# Altium schematic sheet EPS_Local-Supply_Channel.SchDoc: Local Supply / Channel
size A3; SheetNumber: 34; SheetTotal: 51
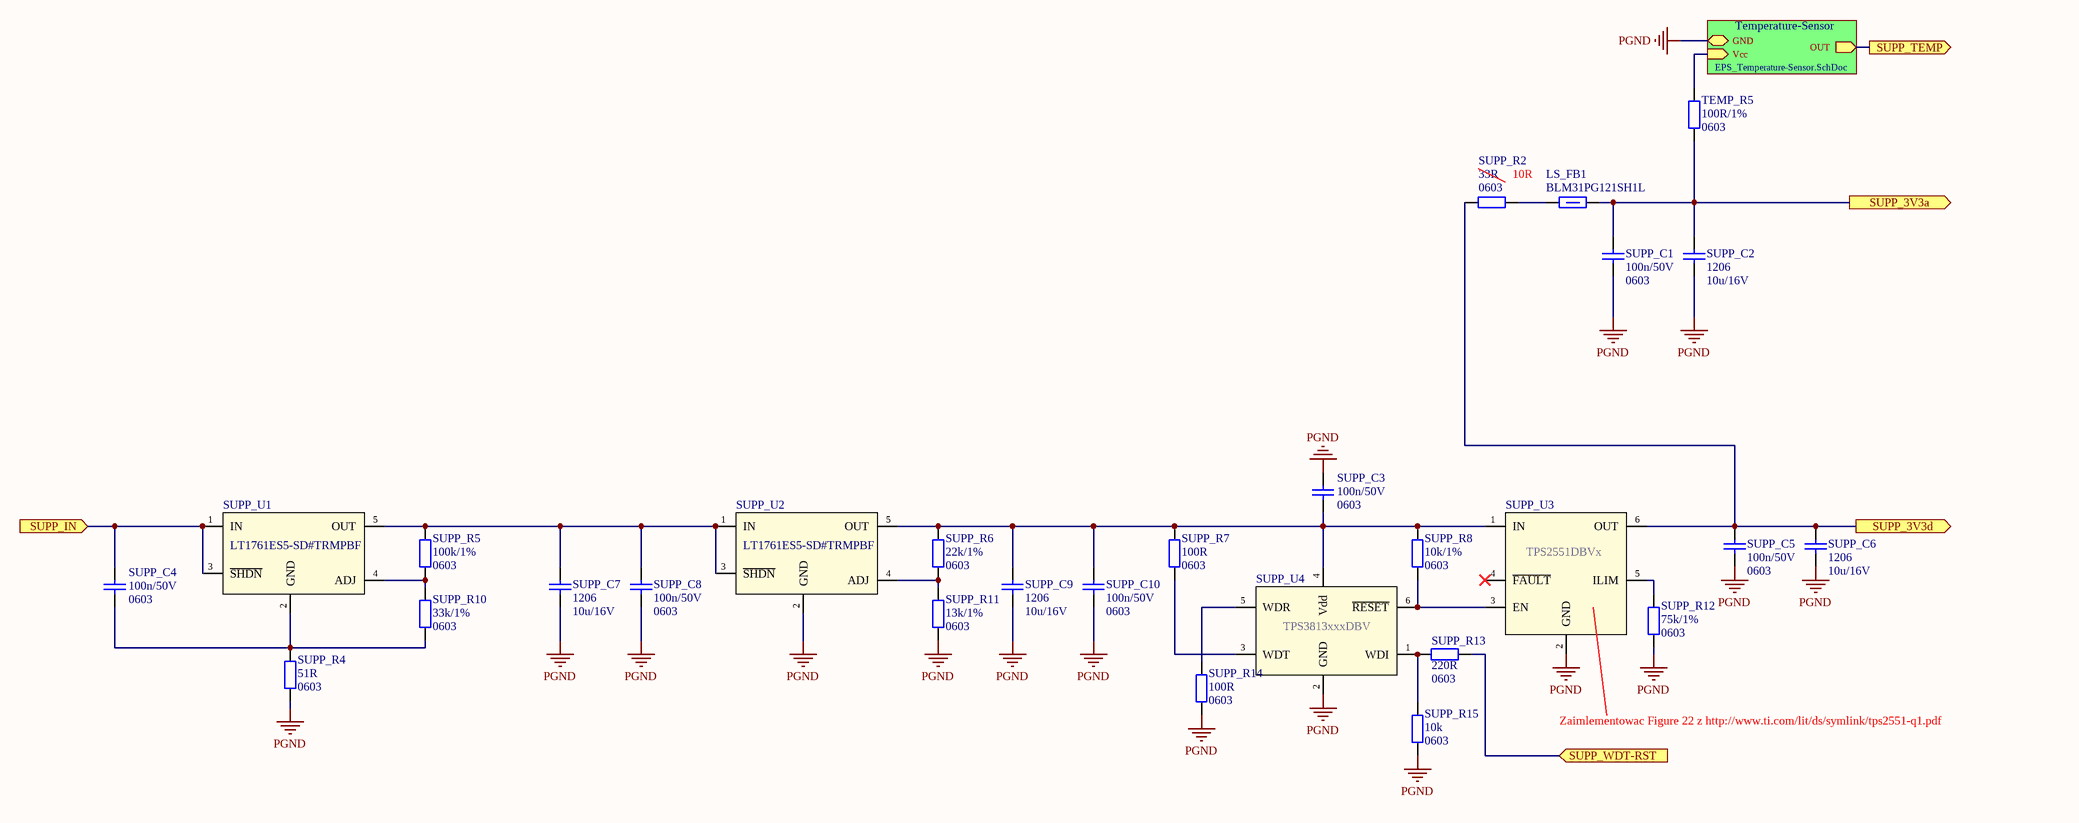
[diagram p0: EPS_Local-Supply_Channel.SchDoc]

## Parts
LS_FB1  120R/100MHz  [SMD_FerriteBead_1206]  (value not drawn)
SUPP_C1  Package: 0603  [SMD_Capacitor_0603]  (hidden comment: 100n/50V)
SUPP_C2  Packge: 1206  [SMD_Capacitor_1206]  (hidden comment: 10u/16V)
SUPP_C3  Package: 0603  [SMD_Capacitor_0603]  (hidden comment: 100n/50V)
SUPP_C4  Package: 0603  [SMD_Capacitor_0603]  (hidden comment: 100n/50V)
SUPP_C5  Package: 0603  [SMD_Capacitor_0603]  (hidden comment: 100n/50V)
SUPP_C6  Packge: 1206  [SMD_Capacitor_1206]  (hidden comment: 10u/16V)
SUPP_C7  Packge: 1206  [SMD_Capacitor_1206]  (hidden comment: 10u/16V)
SUPP_C8  Package: 0603  [SMD_Capacitor_0603]  (hidden comment: 100n/50V)
SUPP_C9  Packge: 1206  [SMD_Capacitor_1206]  (hidden comment: 10u/16V)
SUPP_C10  Package: 0603  [SMD_Capacitor_0603]  (hidden comment: 100n/50V)
SUPP_R2  Package: 0603  [SMD_Resistor_0603]  (hidden comment: 33R)
SUPP_R4  Package: 0603  [SMD_Resistor_0603]  (hidden comment: 51R)
SUPP_R5  Package: 0603  [SMD_Resistor_0603]  (hidden comment: 100k/1%)
SUPP_R6  Package: 0603  [SMD_Resistor_0603]  (hidden comment: 22k/1%)
SUPP_R7  Package: 0603  [SMD_Resistor_0603]  (hidden comment: 100R)
SUPP_R8  Package: 0603  [SMD_Resistor_0603]  (hidden comment: 10k/1%)
SUPP_R10  Package: 0603  [SMD_Resistor_0603]  (hidden comment: 33k/1%)
SUPP_R11  Package: 0603  [SMD_Resistor_0603]  (hidden comment: 13k/1%)
SUPP_R12  Package: 0603  [SMD_Resistor_0603]  (hidden comment: 75k/1%)
SUPP_R13  Package: 0603  [SMD_Resistor_0603]  (hidden comment: 220R)
SUPP_R14  Package: 0603  [SMD_Resistor_0603]  (hidden comment: 100R)
SUPP_R15  Package: 0603  [SMD_Resistor_0603]  (hidden comment: 10k)
SUPP_U1  LT1761ES5-SD#TRMPBF  [SOT23-5]
SUPP_U2  LT1761ES5-SD#TRMPBF  [SOT23-5]
SUPP_U3  TPS2551DBVx  [SOT23-6]
SUPP_U4  TPS3813xxxDBV  [SOT23-6]
TEMP_R5  Package: 0603  [SMD_Resistor_0603]  (hidden comment: 100R/1%)

## Sub-sheets
Temperature-Sensor = EPS_Temperature-Sensor.SchDoc: OUT (out), Vcc (in), GND

## Ports
SUPP_3V3a (out), SUPP_3V3d (out), SUPP_IN (in), SUPP_TEMP (out), SUPP_WDT-RST (in)

## Nets
PGND: SUPP_C1.2 SUPP_C2.2 SUPP_C3.1 SUPP_C5.2 SUPP_C6.2 SUPP_C7.2 SUPP_C8.2 SUPP_C9.2 SUPP_C10.2 SUPP_R4.2 SUPP_R11.2 SUPP_R12.2 SUPP_R14.2 SUPP_R15.1 SUPP_U2.2(GND) SUPP_U3.2(GND) SUPP_U4.2(GND) ; sheet Temperature-Sensor/GND
SUPP_3V3a: LS_FB1.2 SUPP_C1.1 SUPP_C2.1 TEMP_R5.2 ; port SUPP_3V3a
SUPP_3V3d: SUPP_C5.1 SUPP_C6.1 SUPP_R2.1 SUPP_U3.6(OUT) ; port SUPP_3V3d
SUPP_IN: SUPP_C4.1 SUPP_U1.1(IN) SUPP_U1.3(~{SHDN}) ; port SUPP_IN
SUPP_TEMP: port SUPP_TEMP, sheet Temperature-Sensor/OUT
SUPP_WDT-RST: SUPP_R13.2 ; port SUPP_WDT-RST
NetLS_FB1_1: LS_FB1.1 SUPP_R2.2
NetSUPP_C3_2: SUPP_C3.2 SUPP_C9.1 SUPP_C10.1 SUPP_R6.1 SUPP_R7.1 SUPP_R8.1 SUPP_U2.5(OUT) SUPP_U3.1(IN) SUPP_U4.4(Vdd)
NetSUPP_C4_2: SUPP_C4.2 SUPP_R4.1 SUPP_R10.2 SUPP_U1.2(GND)
NetSUPP_C7_1: SUPP_C7.1 SUPP_C8.1 SUPP_R5.1 SUPP_U1.5(OUT) SUPP_U2.1(IN) SUPP_U2.3(~{SHDN})
NetSUPP_R5_2: SUPP_R5.2 SUPP_R10.1 SUPP_U1.4(ADJ)
NetSUPP_R6_2: SUPP_R6.2 SUPP_R11.1 SUPP_U2.4(ADJ)
NetSUPP_R7_2: SUPP_R7.2 SUPP_U4.3(WDT)
NetSUPP_R8_2: SUPP_R8.2 SUPP_U3.3(EN) SUPP_U4.6(~{RESET})
NetSUPP_R12_1: SUPP_R12.1 SUPP_U3.5(ILIM)
NetSUPP_R13_1: SUPP_R13.1 SUPP_R15.2 SUPP_U4.1(WDI)
NetSUPP_R14_1: SUPP_R14.1 SUPP_U4.5(WDR)
NetTEMP_R5_1: TEMP_R5.1 ; sheet Temperature-Sensor/Vcc

Not connected (* = marked no-connect by the designer): SUPP_U3 4(~{FAULT})*

## Notes on the sheet
- 10R
- Zaimlementowac Figure 22 z http://www.ti.com/lit/ds/symlink/tps2551-q1.pdf
- Title:
- Project:
- Author:
- Model:
- Document Number:
- Checked by:
- Rev:
- Date:
- Approved by:
- Sheet:
- of
- File name:

## Library data of the parts
LS_FB1 = BLM31PG121SH1L: Ferrite bead, 1206, 0.02HM, 3.5A.; Manufacturer: Murata; Current Rating: 3.5A; Series Resistance DC: 0.02R; Package: 1206; Value: 120R/100MHz; ManufacturerPartNumber: BLM31PG121SH1L
SUPP_C1 SUPP_C3-SUPP_C5 SUPP_C8 SUPP_C10 = Cer_C0603T104K5RALTU: Ceramic Cap Kemet COTS 100n/50V X7R 0603; Manufacturer: Kemet; ManufacturerPartNumber: C0603T104K5RALTU; Value: 100n/50V
SUPP_C2 SUPP_C6 SUPP_C7 SUPP_C9 = Cer_C1206T106K4RACTU: Ceramic Cap Kemet COTS 10u/16V X7R 1206; ManufacturerPartNumber: C1206T106K4RACTU; Manufacturer: Kemet; Value: 10u/16V
SUPP_R2 SUPP_R4-SUPP_R8 SUPP_R10-SUPP_R15 = Res
  SUPP_R2: Value: 33R
  SUPP_R4: Value: 51R
  SUPP_R5: Value: 100k/1%
  SUPP_R6: Value: 22k/1%
  SUPP_R7 SUPP_R14: Value: 100R
  SUPP_R8: Value: 10k/1%
  SUPP_R10: Value: 33k/1%
  SUPP_R11: Value: 13k/1%
  SUPP_R12: Value: 75k/1%
  SUPP_R13: Value: 220R
  SUPP_R15: Value: 10k
SUPP_U1 SUPP_U2 = LT1761ES5-SD#TRMPBF: 100mA, Regulated, Low Noise, LDO Micropower Regulator in TSOT-23; Manufacturer: Linear Technology; Value: LT1761ES5-SD#TRMPBF
SUPP_U3 = TPS2551DBVx: Adjustable Current-Limited Power-Distribution Switch.; Manufacturer: Texas Instruments; Value: TPS2551DBVx
SUPP_U4 = TPS3813xxxDBV: Processor Supervisory Circuits with Window-Watchdog.; Manufacturer: Texas Instruments; Value: TPS3813xxxDBV
TEMP_R5 = CRCW06031K00FKxxxx: 1k/1% Vishay CRCW 0603 Resistor. 100mW, 100ppm, 75V.; Manufacturer: Vishay; ManufacturerPartNumber: CRCW06031K00FKxxxx; Value: 100R/1%